# EAGLE design ME_433 (EAGLE 9.6.2)
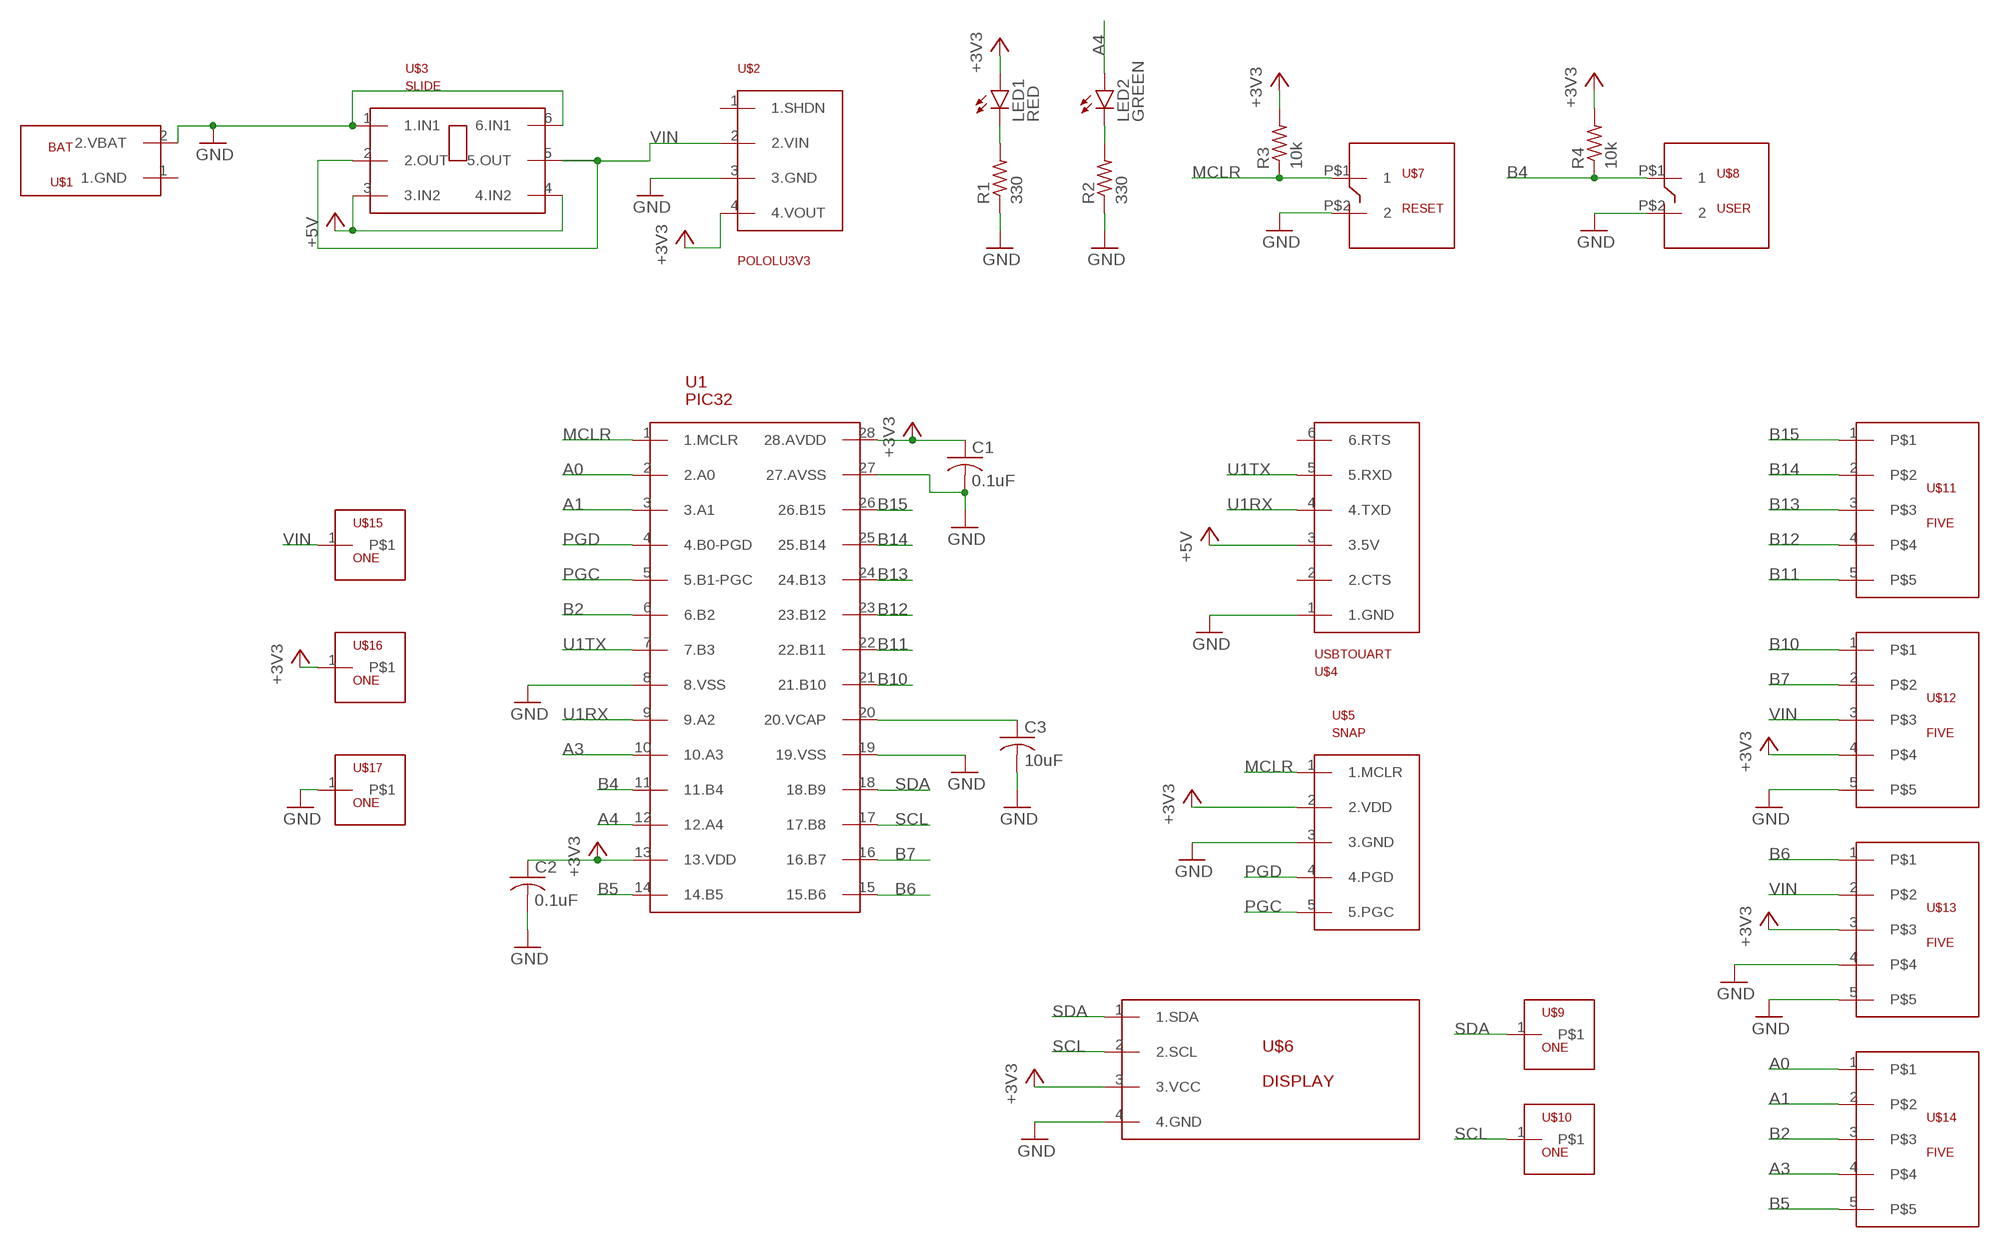
[diagram p0: schematic, sheet 1]

## Parts
C1  0.1uF  C-US025-024X044  [C025-024X044]
C2  0.1uF  C-US025-024X044  [C025-024X044]
C3  10uF  C-US025-024X044  [C025-024X044]
LED1  RED  LED3MM  [LED3MM]
LED2  GREEN  LED3MM  [LED3MM]
R1  330  R-US_0207/7  [0207/7]
R2  330  R-US_0207/7  [0207/7]
R3  10k  R-US_0207/7  [0207/7]
R4  10k  R-US_0207/7  [0207/7]
U1  PIC32  PIC32MX170F256B  [DIL28-3]
U$1  BAT  [BAT]
U$2  POLOLU3V3  [POLOLU3V3]
U$3  SLIDE  [SLIDE]
U$4  USBTOUART  [USBTOUART]
U$5  SNAP  [SNAP]
U$6  DISPLAY  [DISPLAY]
U$7  RESET  PUSH  [PUSH]
U$8  USER  PUSH  [PUSH]
U$9  ONE  [ONE]
U$10  ONE  [ONE]
U$11  FIVE  [FIVE]
U$12  FIVE  [FIVE]
U$13  FIVE  [FIVE]
U$14  FIVE  [FIVE]
U$15  ONE  [ONE]
U$16  ONE  [ONE]
U$17  ONE  [ONE]

## Nets
+3V3: C1.1 C2.1 LED1.A R3.2 R4.2 U1.13(13.VDD) U1.28(28.AVDD) U$2.4(4.VOUT) U$5.2(2.VDD) U$6.3(3.VCC) U$12.4 U$13.3 U$16.1
+5V: U$3.3(3.IN2) U$3.4(4.IN2) U$4.3(3.5V)
A0: U1.2(2.A0) U$14.1
A1: U1.3(3.A1) U$14.2
A3: U1.10(10.A3) U$14.4
A4: LED2.A U1.12(12.A4)
B2: U1.6(6.B2) U$14.3
B4: R4.1 U1.11(11.B4) U$8.P$1
B5: U1.14(14.B5) U$14.5
B6: U1.15(15.B6) U$13.1
B7: U1.16(16.B7) U$12.2
B10: U1.21(21.B10) U$12.1
B11: U1.22(22.B11) U$11.5
B12: U1.23(23.B12) U$11.4
B13: U1.24(24.B13) U$11.3
B14: U1.25(25.B14) U$11.2
B15: U1.26(26.B15) U$11.1
GND: C1.2 C2.2 C3.2 R1.1 R2.1 U1.8(8.VSS) U1.19(19.VSS) U1.27(27.AVSS) U$1.2(2.VBAT) U$2.3(3.GND) U$3.1(1.IN1) U$3.6(6.IN1) U$4.1(1.GND) U$5.3(3.GND) U$6.4(4.GND) U$7.P$2 U$8.P$2 U$12.5 U$13.4 U$13.5 U$17.1
MCLR: R3.1 U1.1(1.MCLR) U$5.1(1.MCLR) U$7.P$1
N$1: LED1.K(C) R1.2
N$3: LED2.K(C) R2.2
N$5: C3.1 U1.20(20.VCAP)
PGC: U1.5(5.B1-PGC) U$5.5(5.PGC)
PGD: U1.4(4.B0-PGD) U$5.4(4.PGD)
SCL: U1.17(17.B8) U$6.2(2.SCL) U$10.1
SDA: U1.18(18.B9) U$6.1(1.SDA) U$9.1
U1RX: U1.9(9.A2) U$4.4(4.TXD)
U1TX: U1.7(7.B3) U$4.5(5.RXD)
VIN: U$2.2(2.VIN) U$3.2(2.OUT) U$3.5(5.OUT) U$12.3 U$13.2 U$15.1
Unconnected: U$1.1(1.GND) U$2.1(1.SHDN) U$4.2(2.CTS) U$4.6(6.RTS)

## Library data of the parts
C1-C3 = ME_433:C-US: CAPACITOR, American symbol; SPICEPREFIX: C
LED1 LED2 = ME_433:LED: LED OSRAM: - CHIPLED LG R971, LG N971, LY N971, LG Q971, LY Q971, LO R971, LY R971 LH N974, LH R974 LS Q976, LO Q976, LY Q976 LO Q996 - Hyper CHIPLED LW Q18S LB Q993, LB Q99A, LB R99A - SideLED LS A670, LO A670, LY A670, LG A670, LP A670 LB A673, LV A673, LT A673, LW A673 LH A674 LY A675 LS A676, LA A676, LO A676, LY A676, LW A676 LS A679, LY A679, LG A679 - Hyper Micro SIDELED® LS Y876, LA Y876, LO Y876, LY Y876 LT Y87S - SmartLED LW L88C, LW L88S LB L89C, LB L89S, LG L890 LS L89K, LO L89K, LY L89K LS L896, LA L896, LO L896, LY L896 - TOPLED LS T670, LO T670, LY T670, LG T670, LP T670 LSG T670, LSP T670, LSY T670, LOP T670, LYG T670 LG T671, LOG T671, LSG T671 LB T673, LV T673, LT T673, LW T673 LH T674 LS T676, LA T676, LO T676, LY T676, LB T676, LH T676, LSB T676, LW T676 LB T67C, LV T67C, LT T67C, LS T67K, LO T67K, LY T67K, LW E67C LS E67B, LA E67B, LO E67B, LY E67B, LB E67C, LV E67C, LT E67C LW T67C LS T679, LY T679, LG T679 LS T770, LO T770, LY T770, LG T770, LP T770 LB T773, LV T773, LT T773, LW T773 LH T774 LS E675, LA E675, LY E675, LS T675 LS T776, LA T776, LO T776, LY T776, LB T776 LHGB T686 LT T68C, LB T68C - Hyper Mini TOPLED® LB M676 - Mini TOPLED Santana® LG M470 LS M47K, LO M47K, LY M47K Source: http://www.osram.convergy.de LUXEON: - LUMILED® LXK2-PW12-R00, LXK2-PW12-S00, LXK2-PW14-U00, LXK2-PW14-V00 LXK2-PM12-R00, LXK2-PM12-S00, LXK2-PM14-U00 LXK2-PE12-Q00, LXK2-PE12-R00, LXK2-PE12-S00, LXK2-PE14-T00, LXK2-PE14-U00 LXK2-PB12-K00, LXK2-PB12-L00, LXK2-PB12-M00, LXK2-PB14-N00, LXK2-PB14-P00, LXK2-PB14-Q00 LXK2-PR12-L00, LXK2-PR12-M00, LXK2-PR14-Q00, LXK2-PR14-R00 LXK2-PD12-Q00, LXK2-PD12-R00, LXK2-PD12-S00 LXK2-PH12-R00, LXK2-PH12-S00 LXK2-PL12-P00, LXK2-PL12-Q00, LXK2-PL12-R00 Source: www.luxeon.com KINGBRIGHT: KA-3528ASYC Source: www.kingbright.com
R1-R4 = ME_433:R-US_: RESISTOR, American symbol; SPICEPREFIX: R
U1 = ME_433:PIC32MX170F256B
U$1 = ME_433:BAT
U$2 = ME_433:POLOLU3V3
U$3 = ME_433:SLIDE
U$4 = ME_433:USBTOUART
U$5 = ME_433:SNAP
U$6 = ME_433:DISPLAY
U$7 U$8 = ME_433:PUSH
U$9 U$10 U$15-U$17 = ME_433:ONE
U$11-U$14 = ME_433:FIVE

## Board
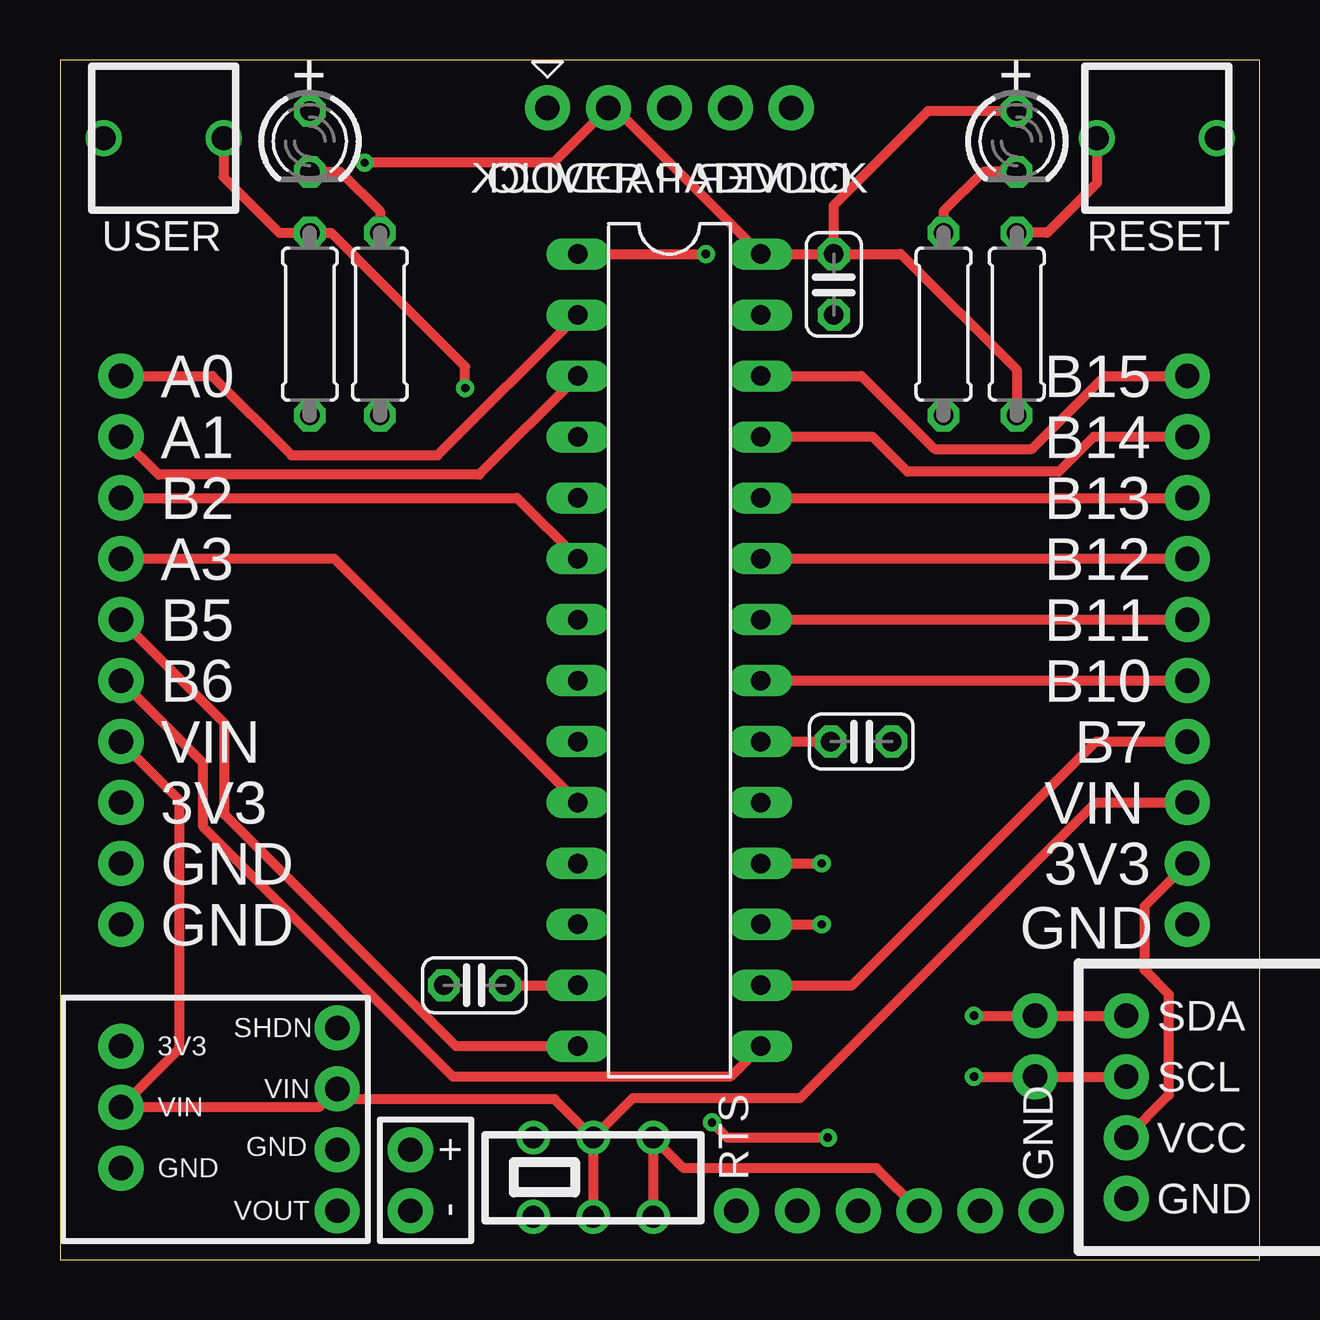
[diagram p1: board, top side]
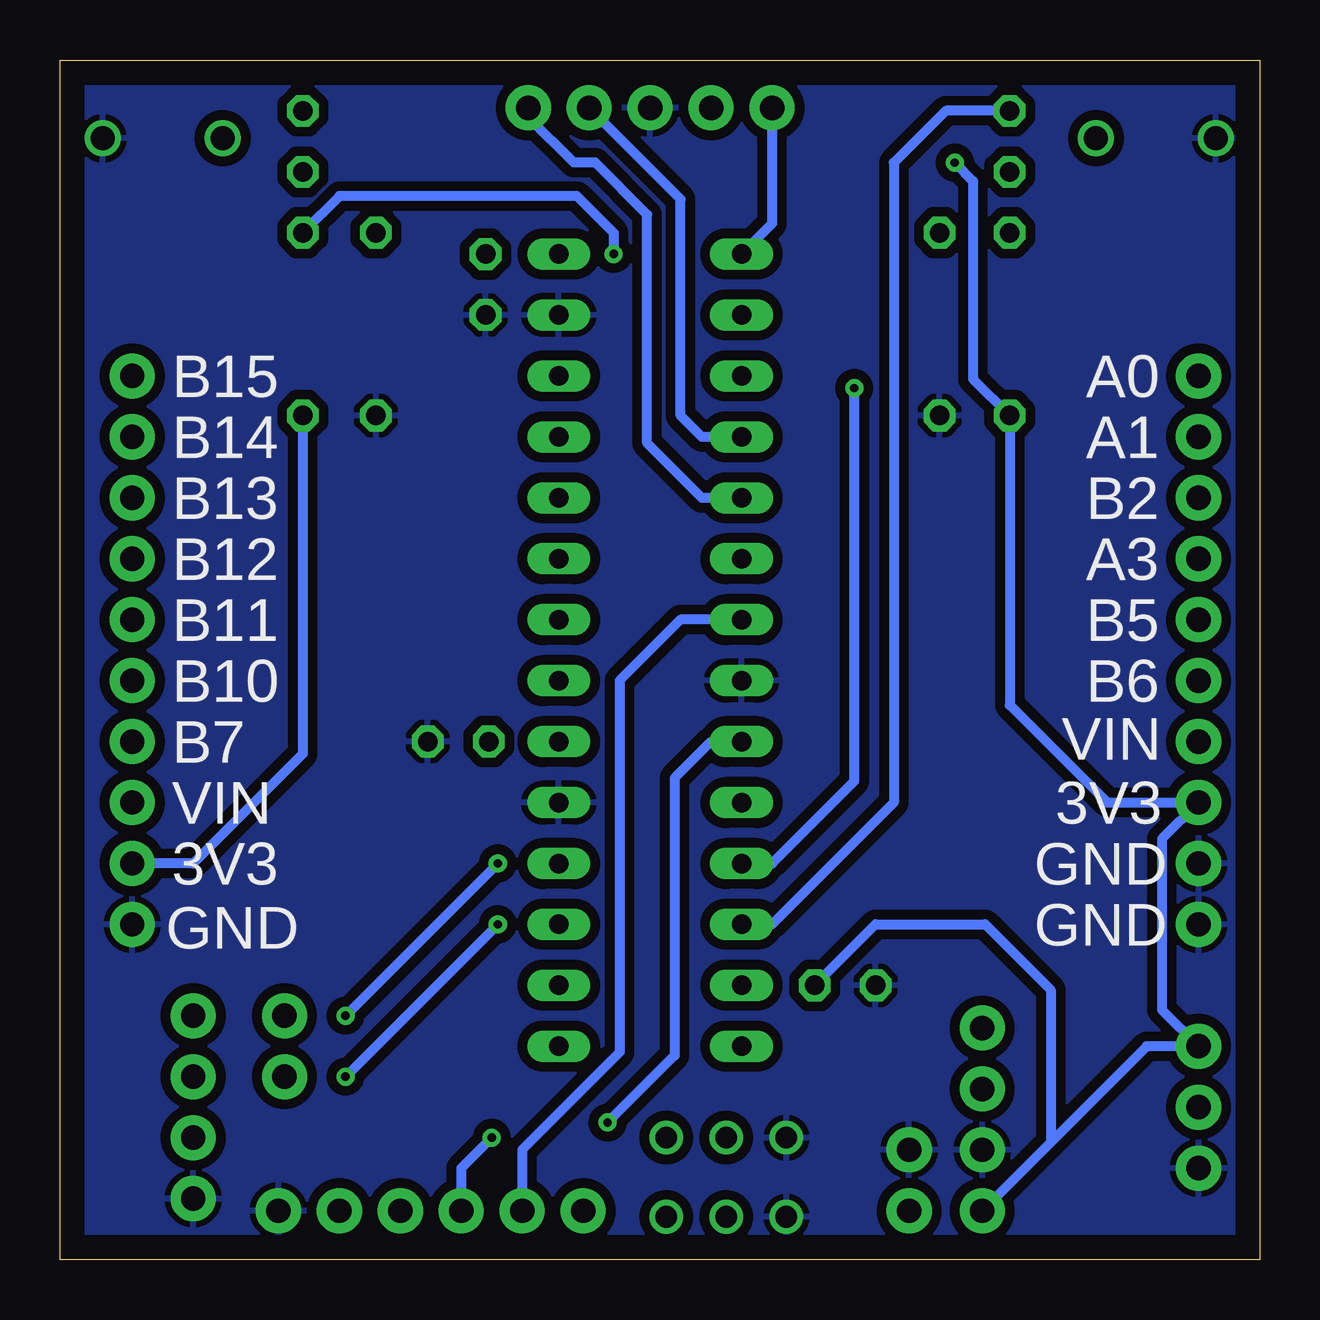
[diagram p2: board, bottom side, seen from below]

Size 50 x 50 mm. Coordinates in mm from the lower left corner, seen from the top.
Outline: 0,0 50,0 50,50 0,50 0,0
Copper layers (1*16): Top 0.035mm / dielectric 1.5mm / Bottom 0.035mm
Design rules "default": minimum track width 6mil, minimum drill 0.35mm, track to track 6mil, track to pad 6mil, pad to pad 6mil, via to via 6mil, smd to smd 6mil, copper to edge 40mil, drill to drill 6mil, minimum pad ring 10mil, minimum via ring 8mil, stop-mask expansion 4mil, vias tented up to drill 0mil, thermal gap 10mil

### Footprints (pad centres in the part's own frame; a part is rotated, then mirrored left to right if it is on the bottom)
C025-024X044 = drill 0.813 octagon: 1 -1.27,0; 2 1.27,0
LED3MM = drill 0.813 octagon: A -1.27,0; K 1.27,0
0207/7 = drill 0.813 octagon: 1 -3.81,0; 2 3.81,0
DIL28-3 = drill 0.813 long: 1 -16.51,-3.81; 2 -13.97,-3.81; 3 -11.43,-3.81; 4 -8.89,-3.81; 5 -6.35,-3.81; 6 -3.81,-3.81; 7 -1.27,-3.81; 8 1.27,-3.81; 9 3.81,-3.81; 10 6.35,-3.81; 11 8.89,-3.81; 12 11.43,-3.81; 13 13.97,-3.81; 14 16.51,-3.81; 15 16.51,3.81; 16 13.97,3.81; 17 11.43,3.81; 18 8.89,3.81; 19 6.35,3.81; 20 3.81,3.81; 21 1.27,3.81; 22 -1.27,3.81; 23 -3.81,3.81; 24 -6.35,3.81; 25 -8.89,3.81; 26 -11.43,3.81; 27 -13.97,3.81; 28 -16.51,3.81
BAT = drill 1.016 pad 1.88: 1 -1.27,0; 2 1.27,0
POLOLU3V3 = drill 1.016 pad 1.88: 1 0,3.81; 2 0,1.27; 3 0,-1.27; 4 0,-3.81
SLIDE = drill 0.9: 1 -2.5,-3.3; 2 0,-3.3; 3 2.5,-3.3; 4 2.5,0; 5 0,0; 6 -2.5,0
USBTOUART = drill 1.016 pad 1.88: 1 -6.35,0; 2 -3.81,0; 3 -1.27,0; 4 1.27,0; 5 3.81,0; 6 6.35,0
SNAP = drill 1.016 pad 1.88: 1 -5.08,0; 2 -2.54,0; 3 0,0; 4 2.54,0; 5 5.08,0
DISPLAY = drill 1.016 pad 1.88: 1 -16.51,3.81; 2 -16.51,1.27; 3 -16.51,-1.27; 4 -16.51,-3.81
PUSH = drill 1: P$1 -2.5,0; P$2 2.5,0
ONE = drill 1.016 pad 1.88: 1 0,0
FIVE = drill 1.016 pad 1.88: 1 -5.08,0; 2 -2.54,0; 3 0,0; 4 2.54,0; 5 5.08,0

### Placement (x,y rotation side)
C1  32.26,40.64 270 top
C2  17.27,11.43 180 top
C3  33.4,21.59 0 top
LED1  39.88,46.61 270 top
LED2  10.41,46.61 270 top
R1  36.83,38.99 90 top
R2  13.34,38.99 90 top
R3  39.88,38.99 270 top
R4  10.41,38.99 270 top
U1  25.4,25.4 270 top
U$1  14.61,3.3 90 top
U$2  11.56,5.84 0 top
U$3  22.23,5.08 0 top
U$4  34.54,2.03 180 top
U$5  25.4,48.01 0 top
U$6  60.96,6.35 0 top
U$7  45.72,46.74 0 top
U$8  4.32,46.74 180 top
U$9  40.64,10.16 0 top
U$10  40.64,7.62 0 top
U$11  46.99,31.75 270 top
U$12  46.99,19.05 270 top
U$13  2.54,19.05 270 top
U$14  2.54,31.75 270 top
U$15  2.54,6.35 0 top
U$16  2.54,8.89 0 top
U$17  2.54,3.81 0 top

### Tracks (layer width: path | path; a pad name or v marks a point on that pad's centre or on a via)
+3V3  (via drill 0.35)
  Top 0.406: C2.1 U1.13 | C1.1 32.26,43.94 36.2,47.88 LED1.A | C1.1 U1.28 23.11,48.01 U$5.2 20.57,45.72 v12.7,45.72 | C1.1 35.05,41.91 39.88,37.08 R3.2 | U$6.3 46.23,6.86 46.23,11.05 45.21,12.06 45.21,14.73 U$12.4
  Bottom 0.406: R3.2 39.88,21.08 44.45,16.51 U$12.4 | 8.7,4.89 4.7,8.89 U$16.1 4.06,10.41 4.06,17.53 U$13.3 6.35,19.05 10.41,23.11 R4.2 11.94,36.7 11.94,44.96 v12.7,45.72 | 8.7,4.89 U$2.4 | C2.1 16,13.97 11.43,13.97 8.7,11.24 8.7,4.89
+5V
  Top 0.406: U$3.3 U$3.4 26,3.81 34.04,3.81 U$4.3
A0
  Top 0.406: U$14.1 6.35,36.83 9.65,33.53 15.75,33.53 U1.2
A1
  Top 0.406: U$14.2 4.12,32.72 17.48,32.72 U1.3
A3
  Top 0.406: U$14.4 11.43,29.21 U1.10
A4
  Bottom 0.406: LED2.A 13.08,47.88 15.24,45.72 15.24,19.05 20.32,13.97 U1.12
B2
  Top 0.406: U$14.3 19.05,31.75 U1.6
B4  (via drill 0.35)
  Top 0.406: U$8.P$1 6.82,45.12 9.14,42.8 R4.1 11.3,42.8 16.89,37.21 v16.89,36.32
  Bottom 0.406: U1.11 20.32,16.51 16.89,19.94 v16.89,36.32
B5
  Top 0.406: U1.14 16.51,8.89 6.86,18.54 6.86,22.35 U$14.5
B6
  Top 0.406: U1.15 27.94,7.62 16.38,7.62 5.97,18.03 5.97,20.7 U$13.1
B7
  Top 0.406: U1.16 33.02,11.43 43.18,21.59 U$12.2
B10
  Top 0.406: U1.21 U$12.1
B11
  Top 0.406: U1.22 U$11.5
B12
  Top 0.406: U1.23 U$11.4
B13
  Top 0.406: U1.24 U$11.3
B14
  Top 0.406: U$11.2 43.08,34.29 41.63,32.84 35.33,32.84 33.88,34.29 U1.25
B15
  Top 0.406: U1.26 33.4,36.83 36.2,34.04 36.32,33.91 36.45,33.78 40.51,33.78 43.56,36.83 U$11.1
GND
  pour Bottom (isolate 0.406): 0,50.8 0,0 50.8,0 50.8,50.8
MCLR  (via drill 0.35)
  Top 0.406: U$7.P$1 43.22,44.87 41.15,42.8 R3.1 | U1.1 v26.92,41.91
  Bottom 0.406: U$5.1 20.32,43.18 U1.1 | v26.92,41.91 26.92,42.8 28.45,44.32 38.35,44.32 R3.1
N$1
  Top 0.406: LED1.K 38.48,45.34 36.83,43.69 R1.2
N$3
  Top 0.406: LED2.K 11.68,45.34 13.34,43.69 R2.2
N$5
  Top 0.406: U1.20 C3.1
PGC
  Bottom 0.406: U1.5 23.24,31.75 25.53,34.04 25.53,43.56 27.69,45.72 28.57,45.72 30.48,47.62 U$5.5
PGD
  Bottom 0.406: U1.4 23.24,34.29 24.13,35.18 24.13,44.2 U$5.4
SCL  (via drill 0.35)
  Top 0.406: U1.17 v31.75,13.97 | v38.1,7.62 U$10.1 U$6.2
  Bottom 0.406: v31.75,13.97 v38.1,7.62
SDA  (via drill 0.35)
  Top 0.406: U1.18 v31.75,16.51 | v38.1,10.16 U$9.1 U$6.1
  Bottom 0.406: v31.75,16.51 v38.1,10.16
U1RX  (via drill 0.35)
  Top 0.406: v32,5.08 27.81,5.08 v27.18,5.71
  Bottom 0.406: U1.9 22.86,21.59 24.38,20.07 24.38,8.51 v27.18,5.71 | v32,5.08 33.27,3.81 U$4.4
U1TX
  Bottom 0.406: U1.7 24.13,26.67 26.67,24.13 26.67,8.64 30.73,4.57 U$4.5
VIN
  Top 0.406: U$3.5 23.88,6.73 30.86,6.73 43.18,19.05 U$12.3 | U$13.2 4.98,19.15 4.98,8.79 U$15.1 10.79,6.35 U$2.2 11.99,6.68 20.62,6.68 U$3.5 | U$3.5 U$3.2

### Text on the board
tPlace: + | + | OLIVER PADDOCK | OLIVER PADDOCK | A0 | B15 | A1 | B14 | B2 | B13 | A3 | B12 | B5 | B11 | B6 | B10 | VIN | B7 | 3V3 | VIN | GND | 3V3 | GND | GND | 3V3 | VIN | GND
bPlace: A0 | B15 | A1 | B14 | B2 | B13 | A3 | B12 | B5 | B11 | B6 | B10 | VIN | B7 | 3V3 | VIN | GND | 3V3 | GND | GND
200bmp: art by my cool girlfriend